# EAGLE schematic 9vRelay (EAGLE 7.3.0)
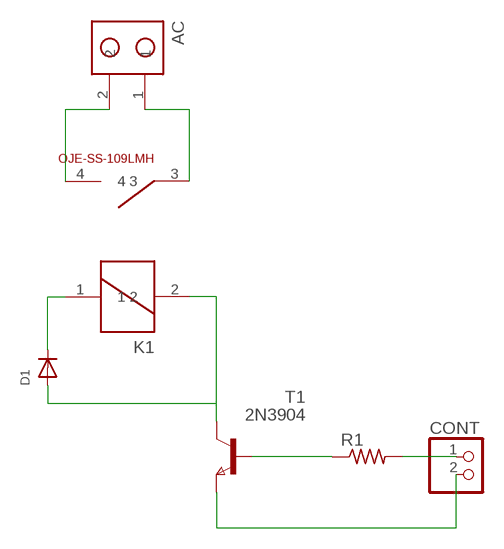
[diagram p0: schematic, sheet 1]

## Parts
AC  TBLOCK1X2  [TBLOCK1X2]
CONT  PINHD-1X2  [1X02]
D1  DIODESMA  [SMADIODE]
K1  OJE-SS-109LMH  [OJE-SS-109LMH]
R1  R-US_R0603  [R0603]
T1  2N3904  FMMT451  [SOT-23]

## Nets
N$1: AC.2 K1.4
N$2: AC.1 K1.3
N$3: D1.A K1.2 T1.1(C)
N$4: D1.C K1.1
N$6: CONT.2 T1.2(E)
N$7: CONT.1 R1.2
N$8: R1.1 T1.3(B)

## Library data of the parts
AC = userdefined:TBLOCK1X2
CONT = pinhead:PINHD-1X2: PIN HEADER
D1 = adafruit:DIODE: Diode SMADIODE - SMA Surface Mount Package 20V 1A Schottky Diode Digikey: 641-1014-6-ND DO-1N4148 - Through Hole Small Current Diode SOD-123 20V 1 A (.5mV Vf) Schottky Diode - Digikey: MBRX120TPMSCT-ND SOD-323 10V 570mA (.38mV Vf, 3ns) Schottky Diode - Digikey: ZLLS410CT-ND SOD-523 30V 30mA Schottky Diode (RB751S-40TE61) - Digikey: RB751S-40TE61CT-ND SOT23-R/W - SOT23 Package (R = Solder Paste/Reflow Ovens, W = Hand-Soldering) BAT54Film 40V 300mA - Digikey: 497-7162-1-ND
K1 = userdefined:OJE-SS-109LMH
R1 = resistor:R-US_: RESISTOR, American symbol
T1 = zetex:FMMT451: NPN TRANSISTOR; OC_FARNELL: unknown; OC_NEWARK: unknown